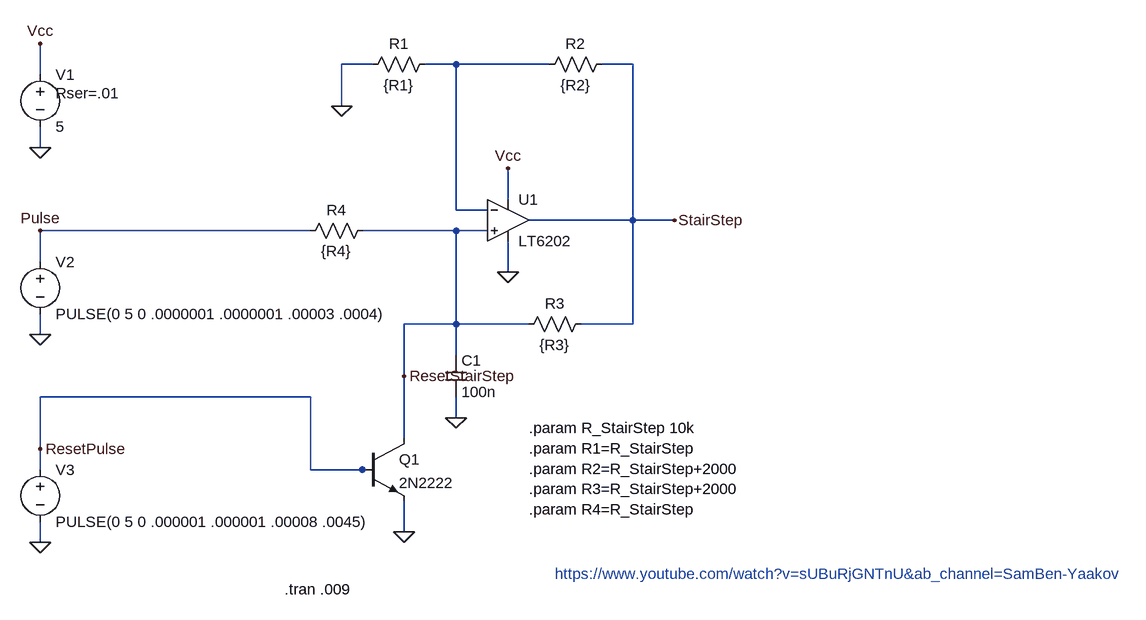
[diagram p0: schematic DebooIntegrator.asc]
DebooIntegrator.asc, the LTspice schematic file:
Version 4
SHEET 1 1380 680
WIRE 128 -144 80 -144
WIRE 256 -144 208 -144
WIRE 400 -144 256 -144
WIRE 528 -144 480 -144
WIRE -384 -128 -384 -176
WIRE 80 -80 80 -144
WIRE -384 -16 -384 -48
WIRE 336 64 336 16
WIRE 256 80 256 -144
WIRE 304 80 256 80
WIRE 528 96 528 -144
WIRE 528 96 368 96
WIRE 592 96 528 96
WIRE 32 112 -384 112
WIRE 256 112 112 112
WIRE 304 112 256 112
WIRE -384 160 -384 112
WIRE 336 176 336 128
WIRE 256 256 256 112
WIRE 256 256 176 256
WIRE 368 256 256 256
WIRE 528 256 528 96
WIRE 528 256 448 256
WIRE -384 272 -384 240
WIRE 256 304 256 256
WIRE 176 336 176 256
WIRE 32 368 -384 368
WIRE 256 400 256 368
WIRE 176 432 176 336
WIRE -384 448 -384 368
WIRE -384 480 -384 448
WIRE 32 480 32 368
WIRE 112 480 32 480
WIRE 128 480 112 480
WIRE 176 576 176 528
WIRE -384 592 -384 560
FLAG 336 16 Vcc
FLAG 336 176 0
FLAG 80 -80 0
FLAG 256 400 0
FLAG 176 576 0
FLAG 592 96 StairStep
FLAG 176 336 ResetStairStep
FLAG -384 -16 0
FLAG -384 272 0
FLAG -384 592 0
FLAG -384 -176 Vcc
FLAG -384 112 Pulse
FLAG -384 448 ResetPulse
SYMBOL npn 112 432 R0
SYMATTR InstName Q1
SYMATTR Value 2N2222
SYMBOL res 128 96 R90
WINDOW 0 0 56 VBottom 2
WINDOW 3 32 56 VTop 2
SYMATTR InstName R4
SYMATTR Value {R4}
SYMBOL res 224 -160 R90
WINDOW 0 0 56 VBottom 2
WINDOW 3 32 56 VTop 2
SYMATTR InstName R1
SYMATTR Value {R1}
SYMBOL res 496 -160 R90
WINDOW 0 0 56 VBottom 2
WINDOW 3 32 56 VTop 2
SYMATTR InstName R2
SYMATTR Value {R2}
SYMBOL res 464 240 R90
WINDOW 0 0 56 VBottom 2
WINDOW 3 32 56 VTop 2
SYMATTR InstName R3
SYMATTR Value {R3}
SYMBOL cap 240 304 R0
SYMATTR InstName C1
SYMATTR Value 100n
SYMBOL OpAmps\\LT6202 336 96 R0
SYMATTR InstName U1
SYMBOL voltage -384 -144 R0
WINDOW 123 0 0 Left 0
WINDOW 39 24 44 Left 2
SYMATTR InstName V1
SYMATTR Value 5
SYMATTR SpiceLine Rser=.01
SYMBOL voltage -384 144 R0
WINDOW 123 0 0 Left 0
WINDOW 39 0 0 Left 0
SYMATTR InstName V2
SYMATTR Value PULSE(0 5 0 .0000001 .0000001 .00003 .0004)
SYMBOL voltage -384 464 R0
WINDOW 123 0 0 Left 0
WINDOW 39 0 0 Left 0
SYMATTR InstName V3
SYMATTR Value PULSE(0 5 0 .000001 .000001 .00008 .0045)
TEXT 368 416 Left 2 !.param R_StairStep 10k\n.param R1=R_StairStep\n.param R2=R_StairStep+2000\n.param R3=R_StairStep+2000\n.param R4=R_StairStep
TEXT -8 664 Left 2 !.tran .009
TEXT 408 640 Left 2 ;https://www.youtube.com/watch?v=sUBuRjGNTnU&ab_channel=SamBen-Yaakov

The netlist it stands for:
* DebooIntegrator.asc
Q1 ResetStairStep ResetPulse 0 0 2N2222
R4 ResetStairStep Pulse {R4}
R1 N001 0 {R1}
R2 StairStep N001 {R2}
R3 StairStep ResetStairStep {R3}
C1 ResetStairStep 0 100n
* U1: LT6202 (symbol OpAmps\LT6202 not available, pins judged from their places): In+=ResetStairStep In-=N001 V+=Vcc V-=0 OUT=StairStep
V1 Vcc 0 5 Rser=.01
V2 Pulse 0 PULSE(0 5 0 .0000001 .0000001 .00003 .0004)
V3 ResetPulse 0 PULSE(0 5 0 .000001 .000001 .00008 .0045)
.model NPN NPN
.model PNP PNP
.lib standard.bjt
.param R_StairStep 10k
.param R1=R_StairStep
.param R2=R_StairStep+2000
.param R3=R_StairStep+2000
.param R4=R_StairStep
.tran .009
* https://www.youtube.com/watch?v=sUBuRjGNTnU&ab_channel=SamBen-Yaakov
.backanno
.end